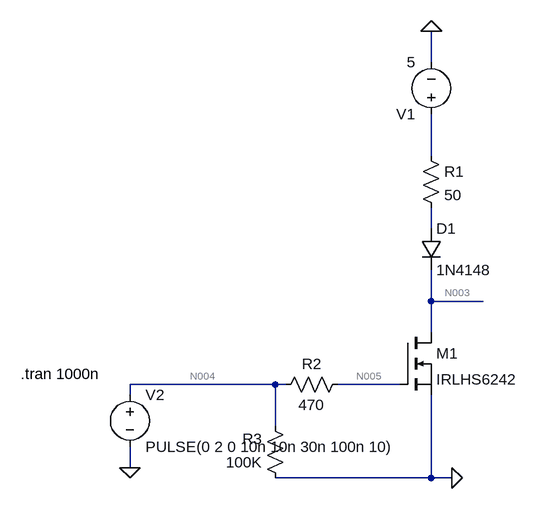
[diagram p0: schematic Draft1.asc]
Draft1.asc, the LTspice schematic file:
Version 4
SHEET 1 880 680
WIRE 320 -272 320 -320
WIRE 320 -128 320 -192
WIRE 320 -16 320 -48
WIRE 320 96 320 48
WIRE 400 96 320 96
WIRE 320 144 320 96
WIRE 80 224 -144 224
WIRE 96 224 80 224
WIRE 272 224 176 224
WIRE -144 240 -144 224
WIRE 80 288 80 224
WIRE -144 352 -144 320
WIRE 320 368 320 240
WIRE 320 368 80 368
WIRE 352 368 320 368
FLAG 352 368 0
FLAG -144 352 0
FLAG 320 -320 0
SYMBOL nmos 272 144 R0
SYMATTR InstName M1
SYMATTR Value IRLHS6242
SYMBOL diode 304 -16 R0
SYMATTR InstName D1
SYMATTR Value 1N4148
SYMBOL res 304 -144 R0
SYMATTR InstName R1
SYMATTR Value 50
SYMBOL voltage 320 -176 R180
WINDOW 123 0 0 Left 0
WINDOW 39 0 0 Left 0
SYMATTR InstName V1
SYMATTR Value 5
SYMBOL voltage -144 224 R0
WINDOW 123 0 0 Left 0
WINDOW 39 0 0 Left 0
SYMATTR InstName V2
SYMATTR Value PULSE(0 2 0 10n 10n 30n 100n 10)
SYMBOL res 192 208 R90
WINDOW 0 0 56 VBottom 2
WINDOW 3 32 56 VTop 2
SYMATTR InstName R2
SYMATTR Value 470
SYMBOL res 96 384 R180
WINDOW 0 36 76 Left 2
WINDOW 3 36 40 Left 2
SYMATTR InstName R3
SYMATTR Value 100K
TEXT -312 208 Left 2 !.tran 1000n

The netlist it stands for:
* Draft1.asc
M1 N003 N005 0 0 IRLHS6242
D1 N002 N003 1N4148
R1 N001 N002 50
V1 N001 0 5
V2 N004 0 PULSE(0 2 0 10n 10n 30n 100n 10)
R2 N005 N004 470
R3 0 N004 100K
.model D D
.lib standard.dio
.model NMOS NMOS
.model PMOS PMOS
.lib standard.mos
.tran 1000n
.backanno
.end

* Results of the author's LTspice run, read from the files saved beside the schematic
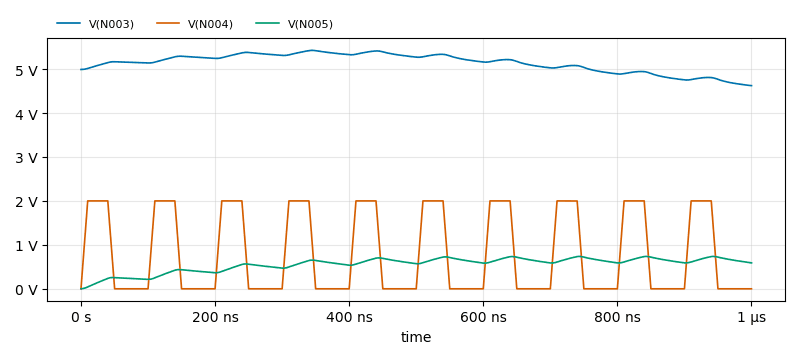
[diagram p1: Transient Analysis of Draft1.asc, plotted from the saved traces]
* Transient Analysis, 1 run:
*   V(N003): min 4.623 V, max 5.426 V, average 5.141 V, rms 5.145 V, last 4.623 V
*   V(N004): min 0 V, max 2 V, average 800 mV, rms 1.213 V, last 0 V
*   V(N005): min 0 V, max 736.8 mV, average 554 mV, rms 577.4 mV, last 590 mV